# EAGLE design SSBSMINI_THROUGHHOLE (EAGLE 9.6.2)
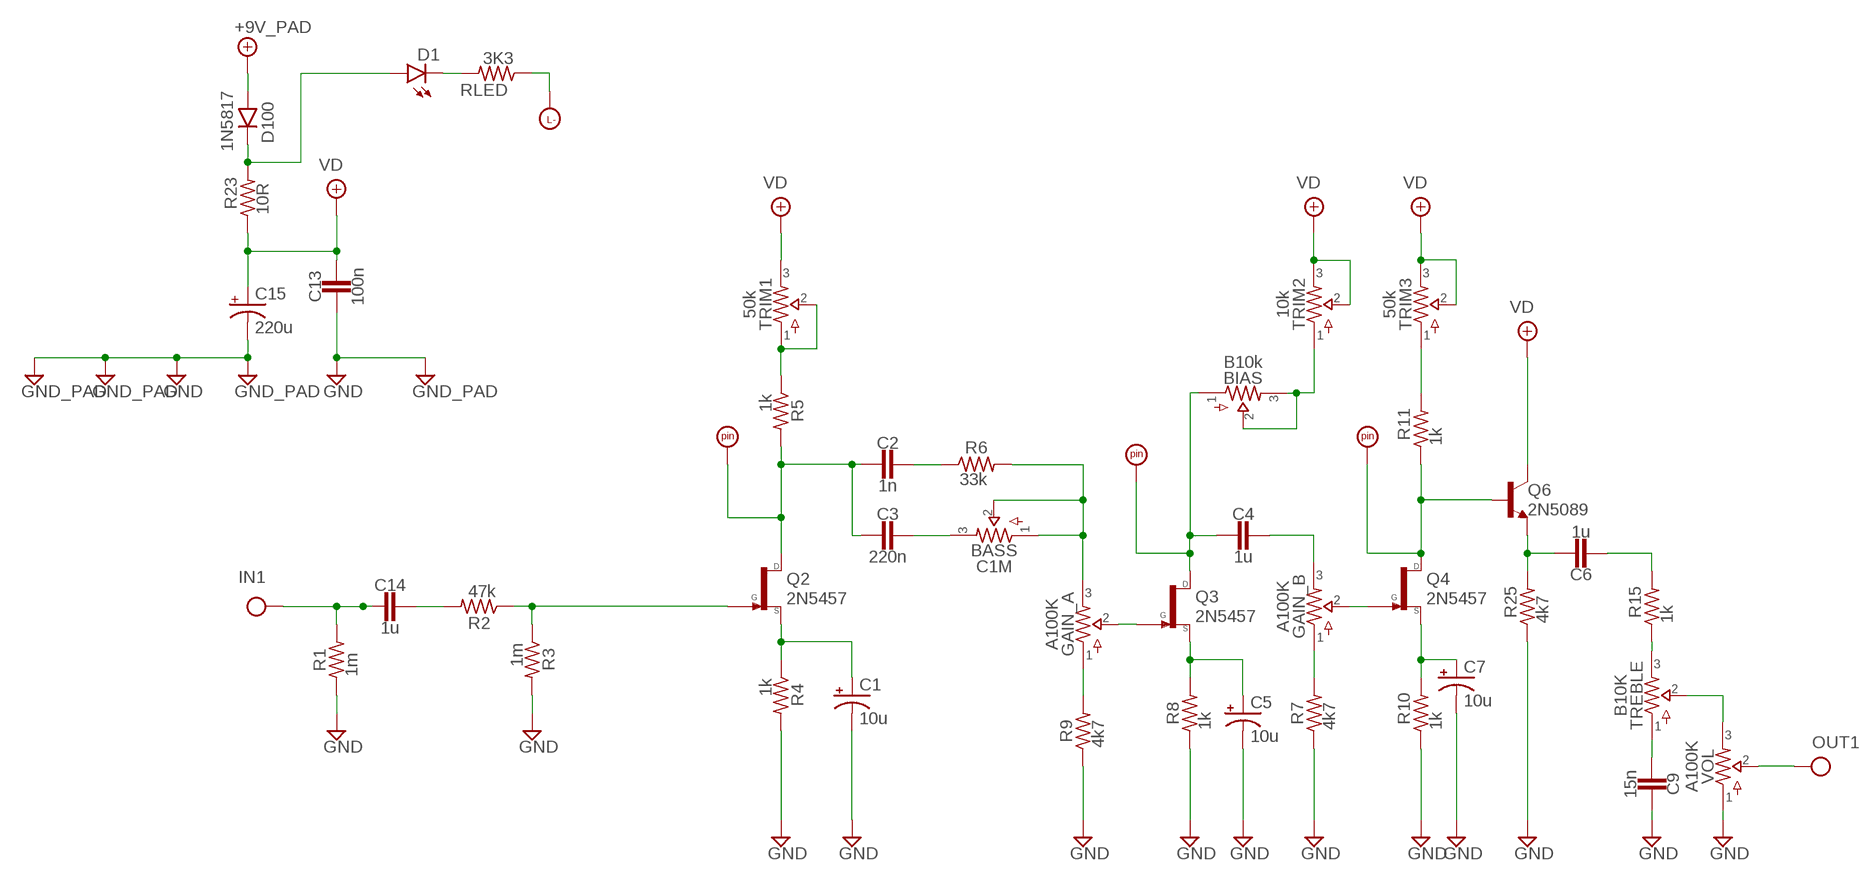
[diagram p0: schematic, sheet 1]

## Parts
BASS  C1M  16MM.1  [16MM_B.MOUNT]
BIAS  B10k  16MM.1  [16MM_B.MOUNT]
C1  10u  0501  [050_020_1]
C2  1n  CAP.2  [0.2".SML]
C3  220n  CAP.3  [0.2".MED]
C4  1u  CAP.3  [0.2".MED]
C5  10u  0501  [050_020_1]
C6  1u  CAP.3  [0.2".MED]
C7  10u  0501  [050_020_1]
C9  15n  CAP.2  [0.2".SML]
C13  100n  CAP.2  [0.2".SML]
C14  1u  CAP.3  [0.2".MED]
C15  220u  0632  [063_025_2]
D1  LED3MM  [LED3MM]
D100  1N5817  DO35.3  [DO35-3]
GAIN  A100K  DUALGANG.2  [16MM_DUALGANG]
GND1  GND_PAD  [SQUARE]
GND17  GND_PAD  [SQUARE]
GND18  GND_PAD  [SQUARE]
GND19  GND_PAD  [SQUARE]
IN1  IN  [SQUARE]
LED  LED-  [SQUARE]
OUT1  OUT  [SQUARE]
Q2  2N5457  [TO92]
Q3  2N5457  [TO92]
Q4  2N5457  [TO92]
Q6  2N5089  2N5088  [TO92]
R1  1m  RESISTORS.2  [R0204/2]
R2  47k  RESISTORS.2  [R0204/2]
R3  1m  RESISTORS.2  [R0204/2]
R4  1k  RESISTORS.2  [R0204/2]
R5  1k  RESISTORS.2  [R0204/2]
R6  33k  RESISTORS.2  [R0204/2]
R7  4k7  RESISTORS.2  [R0204/2]
R8  1k  RESISTORS.2  [R0204/2]
R9  4k7  RESISTORS.2  [R0204/2]
R10  1k  RESISTORS.2  [R0204/2]
R11  1k  RESISTORS.2  [R0204/2]
R15  1k  RESISTORS.2  [R0204/2]
R23  10R  RESISTORS.2  [R0204/2]
R25  4k7  RESISTORS.2  [R0204/2]
RLED  3K3  RESISTORS.2  [R0204/2]
TREBLE  B10K  16MM.1  [16MM_B.MOUNT]
TRIM1  50k  TRIMMER  [TRIM1]
TRIM2  10k  TRIMMER  [TRIM1]
TRIM3  50k  TRIMMER  [TRIM1]
U$5  PADS.RND_NL  [PAD2]
U$6  PADS.RND_NL  [PAD2]
U$7  PADS.RND_NL  [PAD2]
V2  +9V_PAD  [SQUARE]
VOL  A100K  16MM.1  [16MM_B.MOUNT]

## Nets
+9V: D100.A V2.1(+9V)
GND: C1.- C5.- C7.- C9.1 C13.2 C15.- GND1.1(GND) GND17.1(GND) GND18.1(GND) GND19.1(GND) R1.1 R3.2 R4.2 R7.1 R8.1 R9.1 R10.1 R25.1 VOL.1
IN: C14.2 IN1.1(IN) R1.2
N$1: R5.1 TRIM1.1 TRIM1.2
N$2: C14.1 R2.2
N$3: Q2.3(G) R2.1 R3.1
N$4: C1.+ Q2.2(S) R4.1
N$5: C2.2 C3.2 Q2.1(D) R5.2 U$5.P$1
N$6: C2.1 R6.1
N$7: BASS.3 C3.1
N$8: BASS.1 BASS.2 GAIN.3 R6.2
N$9: GAIN.1 R9.2
N$10: D1.A D100.C R23.2
N$11: GAIN.2 Q3.3(G)
N$12: C5.+ Q3.2(S) R8.2
N$13: D1.K(C) RLED.2
N$14: C4.1 GAIN.6
N$15: GAIN.4 R7.2
N$16: C7.+ Q4.2(S) R10.2
N$17: Q4.1(D) Q6.2(B) R11.1 U$7.P$1
N$18: GAIN.5 Q4.3(G)
N$19: C6.1 Q6.3(E) R25.2
N$20: C6.2 R15.2
N$21: R15.1 TREBLE.3
N$22: C9.2 TREBLE.1
N$23: TREBLE.2 VOL.3
N$24: LED.1 RLED.1
N$25: BIAS.2 BIAS.3 TRIM2.1
N$27: BIAS.1 C4.2 Q3.1(D) U$6.P$1
N$28: R11.2 TRIM3.1
OUT: OUT1.1(OUT) VOL.2
VD: C13.1 C15.+ Q6.1(C) R23.1 TRIM1.3 TRIM2.2 TRIM2.3 TRIM3.2 TRIM3.3

## Library data of the parts
BASS BIAS TREBLE VOL = potentiometers:16MM: 16mm Poteniometers
C1 C5 C7 = caps-elec:050: 0.22 - 100uF Xicon values at Mouser.com: 10V: 10 - 100uF; 16V: 2.2 - 47uF; 25V: 0.47 - 47uF; 50V: 0.22 - 22uF
C2-C4 C6 C9 C13 C14 = caps-film:CAP: For Ceramic, Film, MLCC caps
C15 = caps-elec:063: 33 - 220uF Xicon values at Mouser.com 10V: 220uF; 16V: 100uF; 25V: 100uF; 50V: 33uF
D1 = diodes:LED
D100 = diodes:DO35: DO-35 Package Diodes: 1N914
GAIN = potentiometers:DUALGANG: Dual-Gan Potentiometers
GND1 GND17-GND19 = supply pins:GND_PAD: Ground use this to hook up ground connections throughout a schematic instead of running wire automatically labels the net "GND"
IN1 = supply pins:IN: Input obsolete: use Mark instead and label net schematic input label without circuit board terminal/pad labels net "IN" provided as complement to OUT (rarely used)
LED = supply pins:LED-
OUT1 = supply pins:OUT: Output obsolete: use Mark instead and label net output label without circuit board terminal/pad commonly used as output label on 2nd lug of a potentiometer
Q2-Q4 = transistors-FET:2N5457: 2n5457, J201, MPF102 [D]-S-G pinout, N-Channel 2n5457: http://smallbear-electronics.mybigcommerce.com/transistor-fet-2n5457/ J201: http://smallbear-electronics.mybigcommerce.com/transistor-fet-j201-national-semi/ J201: http://smallbear-electronics.mybigcommerce.com/transistor-fet-j201-vishay-siliconix/ MPF102: http://smallbear-electronics.mybigcommerce.com/transistor-fet-mpf102/
Q6 = transistors-BJT:2N5088: NPN - 2n5088, 2n5089, 2n3904, MPSA18 [C]-B-E pinout 2n5088: http://smallbear-electronics.mybigcommerce.com/transistor-2n5088/ 2n5089: http://smallbear-electronics.mybigcommerce.com/transistor-2n5089/ 2n5089: http://smallbear-electronics.mybigcommerce.com/transistor-2n5089-motorola/ 2n3904: http://smallbear-electronics.mybigcommerce.com/transistor-2n3904/ MPSA18: http://smallbear-electronics.mybigcommerce.com/transistor-mpsa18/
R1-R11 R15 R23 R25 RLED = resistors:RESISTORS
TRIM1-TRIM3 = potentiometers:TRIMMER: Trimpots
U$5-U$7 = supply pins:PADS.: Pads For I/O connections or test point pads on PCBs.
V2 = supply pins:+9V_PAD: +9V Voltage Supply use this to hook up +9v throughout a schematic instead of running wire automatically labels the net "+9v"

## Board
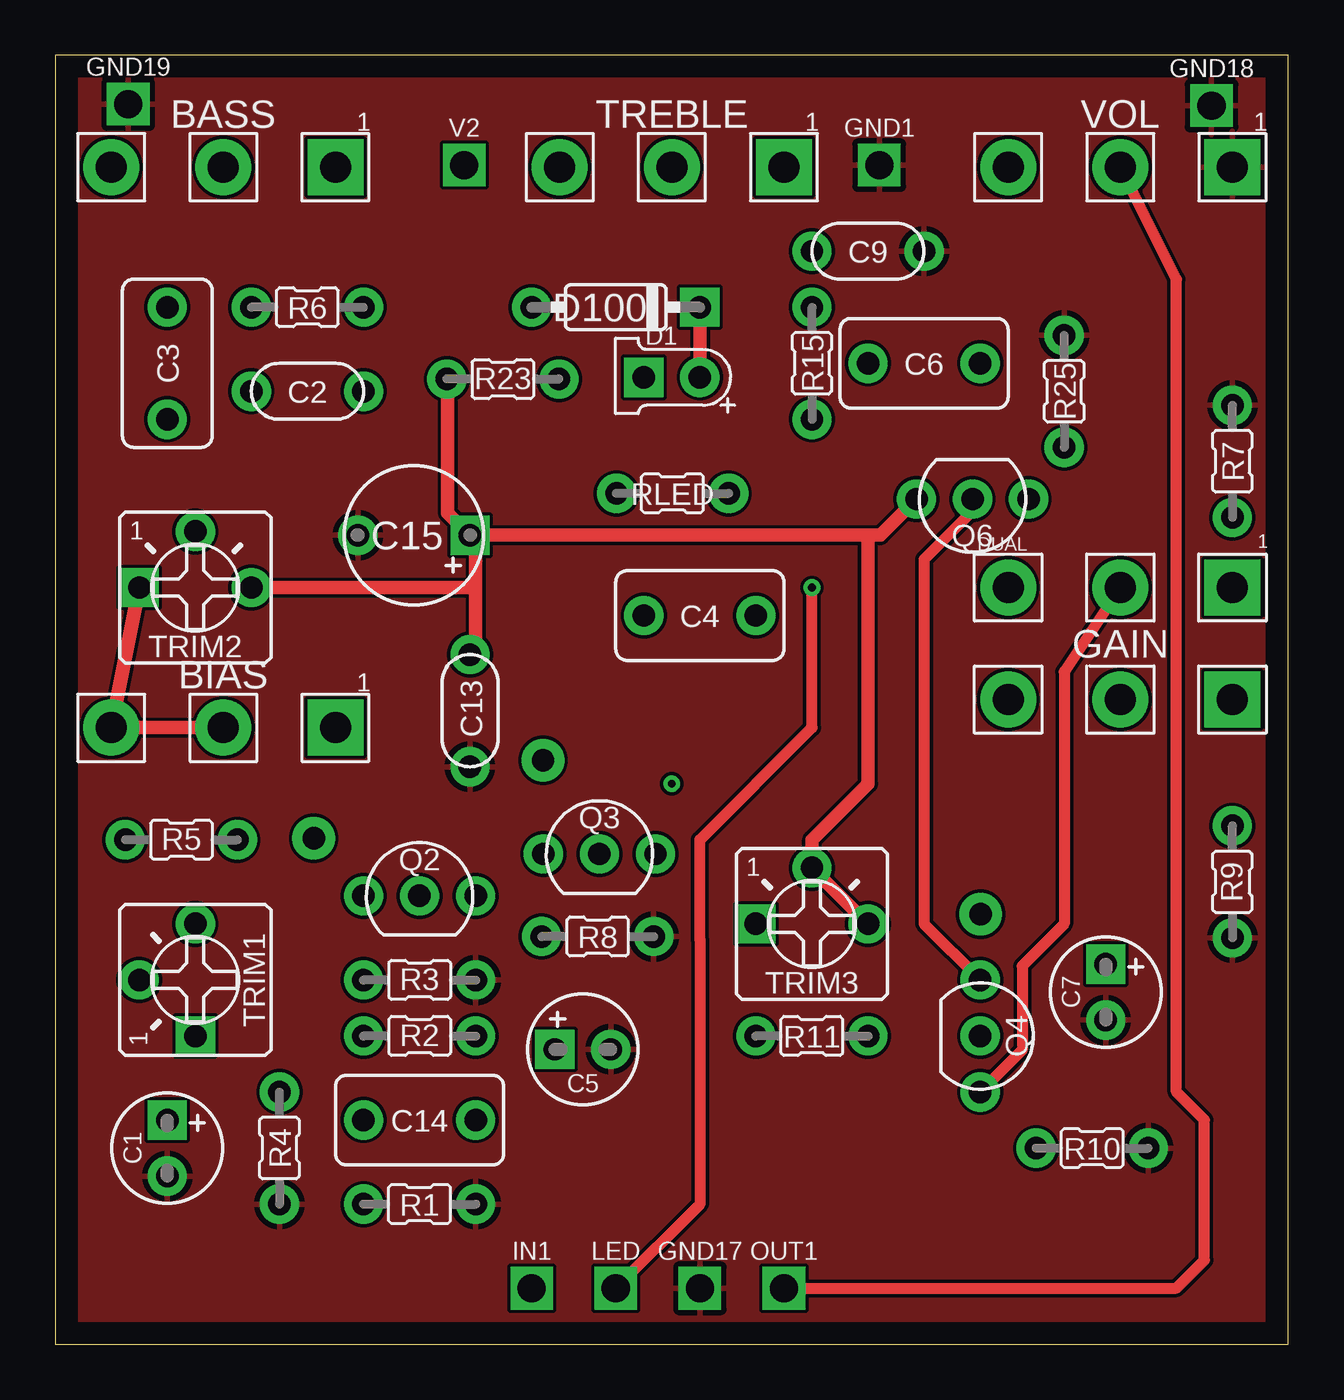
[diagram p1: board, top side]
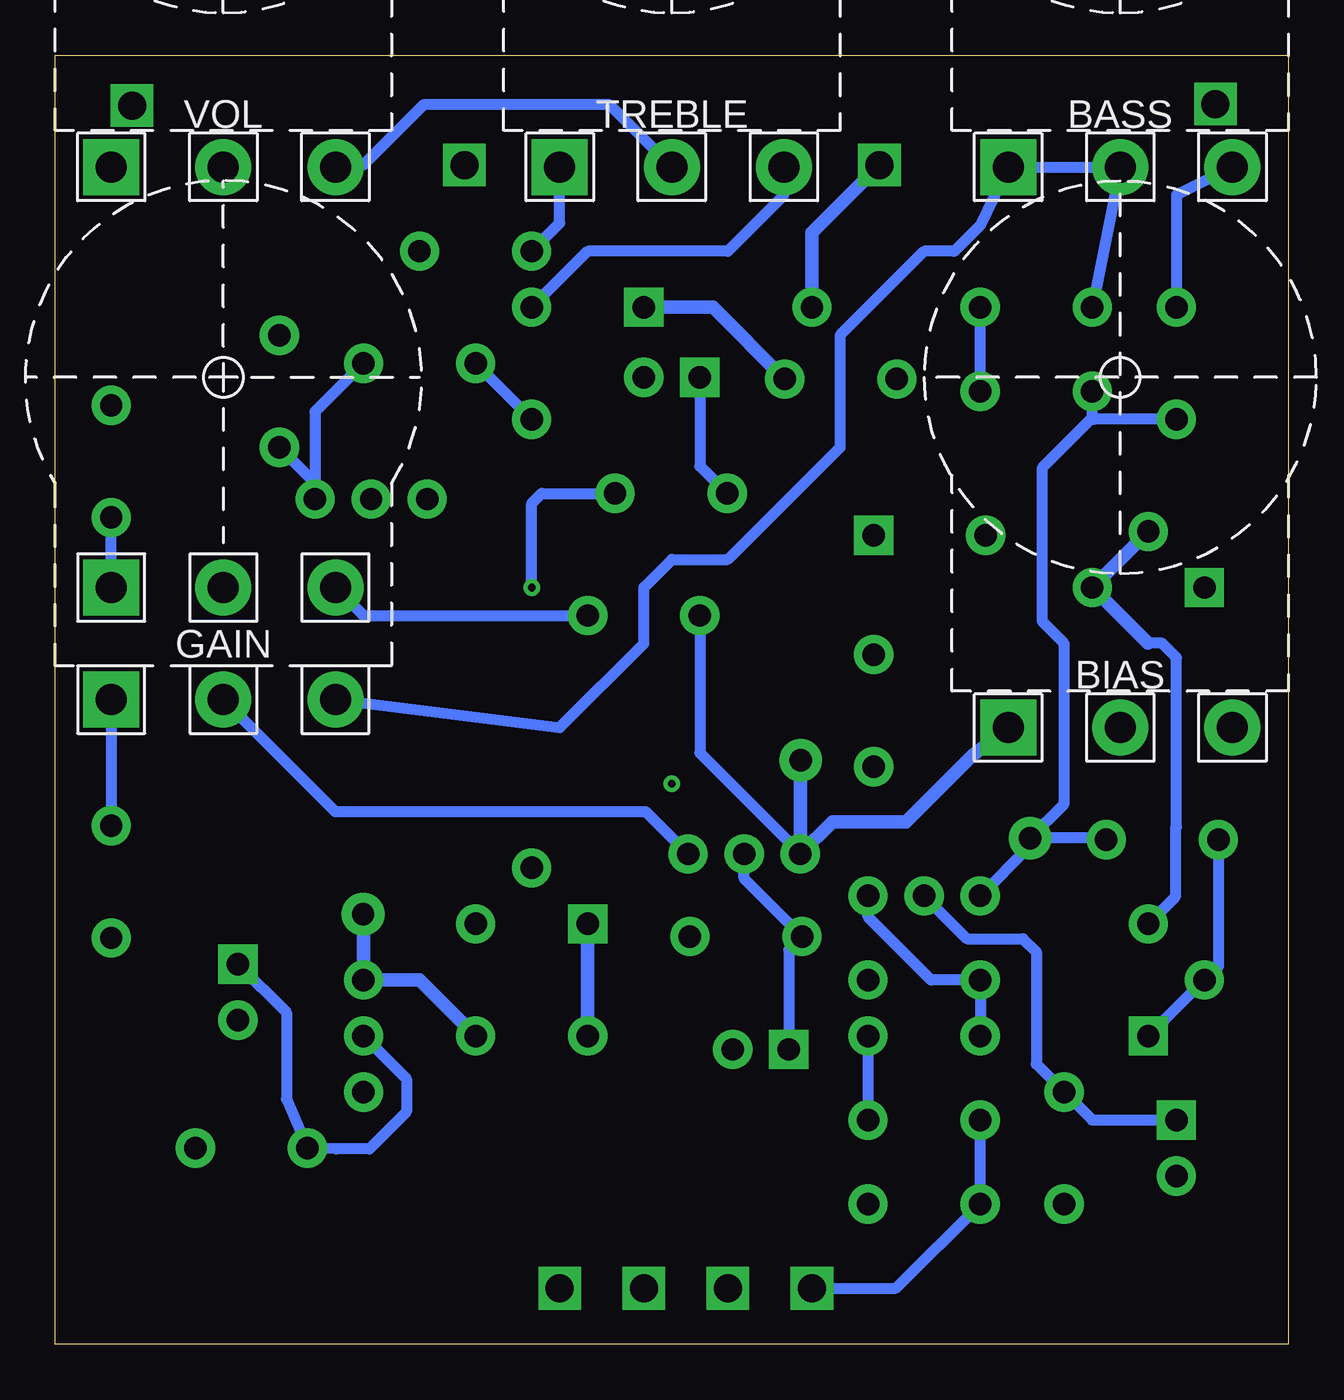
[diagram p2: board, bottom side, seen from below]

Size 55.88 x 58.41 mm. Coordinates in mm from the lower left corner, seen from the top.
Outline: 0,0 55.88,0 55.88,58.41 0,58.41 0,0
Copper layers (1*16): Top 0.035mm / dielectric 1.5mm / Bottom 0.035mm
Design rules "default": minimum track width 6mil, minimum drill 0.35mm, track to track 6mil, track to pad 6mil, pad to pad 6mil, via to via 6mil, smd to smd 6mil, copper to edge 40mil, drill to drill 6mil, minimum pad ring 10mil, minimum via ring 8mil, stop-mask expansion 4mil, vias tented up to drill 0mil, thermal gap 10mil

### Footprints (pad centres in the part's own frame; a part is rotated, then mirrored left to right if it is on the bottom)
16MM_B.MOUNT = drill 1.4 pad 2.54 square: 1 5.08,0 | drill 1.4 pad 2.54: 2 0,0; 3 -5.08,0
050_020_1 = drill 1.016 pad 1.778 square: + -1.27,0 | drill 1.016 pad 1.778: - 1.27,0
0.2".SML = drill 1.016 pad 1.778: 1 -2.54,0; 2 2.54,0
0.2".MED = drill 1.016 pad 1.778: 1 -2.54,0; 2 2.54,0
063_025_2 = drill 1.016 pad 1.778 square: + -2.54,0 | drill 1.016 pad 1.778: - 2.54,0
LED3MM = drill 1.016 pad 1.778: A -1.27,0 | drill 1.016 pad 1.778 square: K 1.27,0
DO35-3 = drill 1.016 pad 1.778: A 3.81,0 | drill 1.016 pad 1.778 square: C -3.81,0
16MM_DUALGANG = drill 1.4 pad 2.54 square: 1 5.08,0; 4 5.08,5.08 | drill 1.4 pad 2.54: 2 0,0; 3 -5.08,0; 5 0,5.08; 6 -5.08,5.08
SQUARE = drill 1.27 pad 1.93 square: 1 0,0
TO92 = drill 1.016 pad 1.778: 1 -2.54,0; 2 0,0; 3 2.54,0
R0204/2 = drill 1.016 pad 1.778: 1 -2.54,0; 2 2.54,0
TRIM1 = drill 1.016 pad 1.778 square: 1 -2.54,0 | drill 1.016 pad 1.778: 2 0,2.54; 3 2.54,0
PAD2 = drill 1.016 pad 1.93: P$1 0,0

### Placement (x,y rotation side)
BASS  7.62,53.34 0 top
BIAS  7.62,27.94 0 top
C1  5.08,8.89 270 top
C2  11.43,43.18 180 top
C3  5.08,44.45 270 top
C4  29.21,33.02 180 top
C5  23.91,13.36 0 top
C6  39.37,44.45 180 top
C7  47.6,15.96 270 top
C9  36.83,49.53 180 top
C13  18.79,28.71 270 top
C14  16.51,10.16 180 top
C15  16.26,36.66 180 top
D1  27.94,43.81 180 top
D100  25.4,46.99 180 top
GAIN  48.26,29.21 0 top
GND1  37.34,53.43 0 top
GND17  29.21,2.54 0 top
GND18  52.39,56.13 0 top
GND19  3.31,56.19 0 top
IN1  21.59,2.54 0 top
LED  25.4,2.54 0 top
OUT1  33.02,2.54 0 top
Q2  16.51,20.32 0 top
Q3  24.66,22.22 0 top
Q4  41.91,13.97 270 top
Q6  41.57,38.3 0 top
R1  16.51,6.35 180 top
R2  16.51,13.97 0 top
R3  16.51,16.51 0 top
R4  10.16,8.89 270 top
R5  5.71,22.86 0 top
R6  11.43,46.99 180 top
R7  53.34,40 270 top
R8  24.58,18.48 180 top
R9  53.34,20.96 90 top
R10  46.99,8.89 180 top
R11  34.29,13.97 180 top
R15  34.29,44.45 270 top
R23  20.29,43.73 0 top
R25  45.72,43.18 270 top
RLED  27.97,38.55 180 top
TREBLE  27.94,53.34 0 top
TRIM1  6.35,16.51 90 top
TRIM2  6.35,34.29 0 top
TRIM3  34.29,19.05 0 top
U$2  [3PDT]  27.94,-19.05 0 top  (outside the outline)
U$3  [LUMBURG_TOP]  15.24,82.55 0 top  (outside the outline)
U$4  [LUMBURG_TOP]  40.64,82.55 0 bottom  (outside the outline)
U$5  11.71,22.93 0 top
U$6  22.1,26.46 0 top
U$7  41.93,19.5 0 top
V2  18.53,53.43 0 top
VOL  48.26,53.34 0 top

### Tracks (layer width: path | path; a pad name or v marks a point on that pad's centre or on a via)
+9V
  Bottom 0.61: V2.1 21.59,50.37 D100.A
GND
  pour Top: 55.83,58.42 55.88,0 0,0 0,58.42
IN
  Bottom 0.508: IN1.1 17.78,2.54 R1.2 C14.2
N$1
  Bottom 0.508: R5.1 3.17,17.14 TRIM1.2 TRIM1.1
N$2
  Bottom 0.508: R2.2 C14.1
N$3
  Bottom 0.508: R2.1 R3.1 16.19,16.51 19.05,19.37 19.05,19.48 Q2.3
N$4
  Bottom 0.508: C1.+ 8.89,10.16 R4.1 11.43,12.7 11.43,17.78 12.03,18.38 14.57,18.38 Q2.2
N$5
  Bottom 0.508: Q2.1 11.71,22.58 U$5.P$1 | R5.2 8.33,22.93 U$5.P$1 | 8.89,41.98 C2.2 | 8.89,41.98 11.15,39.72 11.15,32.74 10.16,31.75 10.16,24.49 U$5.P$1 | C3.2 8.82,41.91 8.89,41.98
N$6
  Bottom 0.508: C2.1 R6.1
N$7
  Bottom 0.508: BASS.3 5.08,52.07 C3.1
N$8
  Bottom 0.508: R6.2 BASS.2 BASS.1 13.97,50.7 15.14,49.53 16.51,49.53 20.32,45.72 20.32,40.64 25.4,35.56 27.94,35.56 29.21,34.29 29.21,31.75 33.02,27.94 GAIN.3
N$9
  Bottom 0.508: GAIN.1 R9.2
N$10
  Top 0.61: D100.C D1.A
  Bottom 0.61: R23.2 26.08,46.99 D100.C
N$11
  Bottom 0.508: Q3.3 29.11,24.13 43.18,24.13 GAIN.2
N$12
  Bottom 0.508: Q3.2 24.66,21.1 R8.2 22.64,17.88 C5.+
N$13
  Bottom 0.508: D1.K 26.67,39.79 RLED.2
N$14
  Bottom 0.508: GAIN.6 41.91,33.02 C4.1
N$15
  Bottom 0.508: GAIN.4 R7.2
N$16
  Bottom 0.508: Q4.2 39.96,12.02 39.96,10.53 41.64,8.85 43.14,8.85 R10.2 45.4,11.11 45.4,15.03 C7.+
N$17
  Top 0.508: Q6.2 41.57,37.76 39.37,35.56 39.37,19.05 Q4.1
  Bottom 0.61: U$7.P$1 41.91,19.48 Q4.1 39.37,16.51 R11.1
N$18
  Top 0.508: GAIN.5 45.72,30.48 45.72,19.05 43.82,17.14 43.82,13.34 Q4.3
N$19
  Bottom 0.508: R25.2 44.11,39.03 Q6.3 44.11,42.25 C6.1
N$20
  Bottom 0.508: R15.2 C6.2
N$21
  Bottom 0.508: TREBLE.3 22.86,52.07 25.4,49.53 31.75,49.53 R15.1
N$22
  Bottom 0.508: C9.2 33.02,50.8 TREBLE.1
N$23
  Bottom 0.508: TREBLE.2 30.76,56.16 39.2,56.16 41.91,53.44 VOL.3
N$24  (via drill 0.35)
  Top 0.508: LED.1 29.23,6.38 29.23,18.32 29.21,18.34 29.21,22.86 34.29,27.94 v34.29,34.29
  Bottom 0.508: v34.29,34.29 34.29,38.1 33.84,38.55 RLED.1
N$25
  Top 0.61: TRIM2.1 BIAS.3 BIAS.2
N$26  (via drill 0.35)
  other vias: 27.94,25.4
N$27
  Bottom 0.508: Q3.1 22.11,22.24 26.67,26.8 C4.2
  Bottom 0.61: BIAS.1 14.33,26.67 17.32,23.68 20.66,23.68 22.11,22.24 U$6.P$1
N$28
  Bottom 0.61: TRIM3.1 R11.2
OUT
  Top 0.508: OUT1.1 50.8,2.54 52.07,3.81 52.07,10.16 50.8,11.43 50.8,48.26 VOL.2
VD
  Top 0.61: TRIM2.3 19.05,34.29 | C15.+ 19.05,36.4 19.05,34.29 | 19.05,34.29 19.05,31.51 C13.1 | R23.1 17.78,43.7 17.78,37.67 C15.+ | C15.+ 36.83,36.66 | 36.83,36.66 37.39,36.66 Q6.1 | TRIM3.3 TRIM3.2 34.29,22.86 36.83,25.4 36.83,36.66
  Bottom 0.508: TRIM1.3 5.11,20.29 5.11,23.4 5.08,23.42 5.08,31.11 5.74,31.77 6.37,31.77
  Bottom 0.61: TRIM2.2 TRIM2.3 6.37,31.77